# EAGLE design untitled (EAGLE 9.4.2)
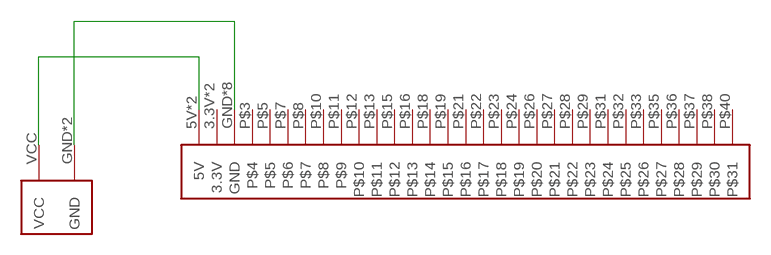
[diagram p0: schematic, sheet 1]

## Parts
U$1  DCジャック  [DCジャック]
U$2  PINHEADER_220  [PINHEADER_2*20]

## Nets
N$1: U$1.VCC U$2.5V U$2.5V_(5V)
N$2: U$1.GND U$1.GND2(GND) U$2.GND U$2.GND1(GND) U$2.GND2(GND) U$2.GND3(GND) U$2.GND4(GND) U$2.GND5(GND) U$2.GND6(GND) U$2.GND7(GND)
Unconnected: U$2.3.3V U$2.3.3V_(3.3V) U$2.P$3 U$2.P$5 U$2.P$7 U$2.P$8 U$2.P$10 U$2.P$11 U$2.P$12 U$2.P$13 U$2.P$15 U$2.P$16 U$2.P$18 U$2.P$19 U$2.P$21 U$2.P$22 U$2.P$23 U$2.P$24 U$2.P$26 U$2.P$27 U$2.P$28 U$2.P$29 U$2.P$31 U$2.P$32 U$2.P$33 U$2.P$35 U$2.P$36 U$2.P$37 U$2.P$38 U$2.P$40

## Library data of the parts
U$1 = dcジャック_mirror:DCジャック
U$2 = thinker_pinheader:PINHEADER_2*20

## Board
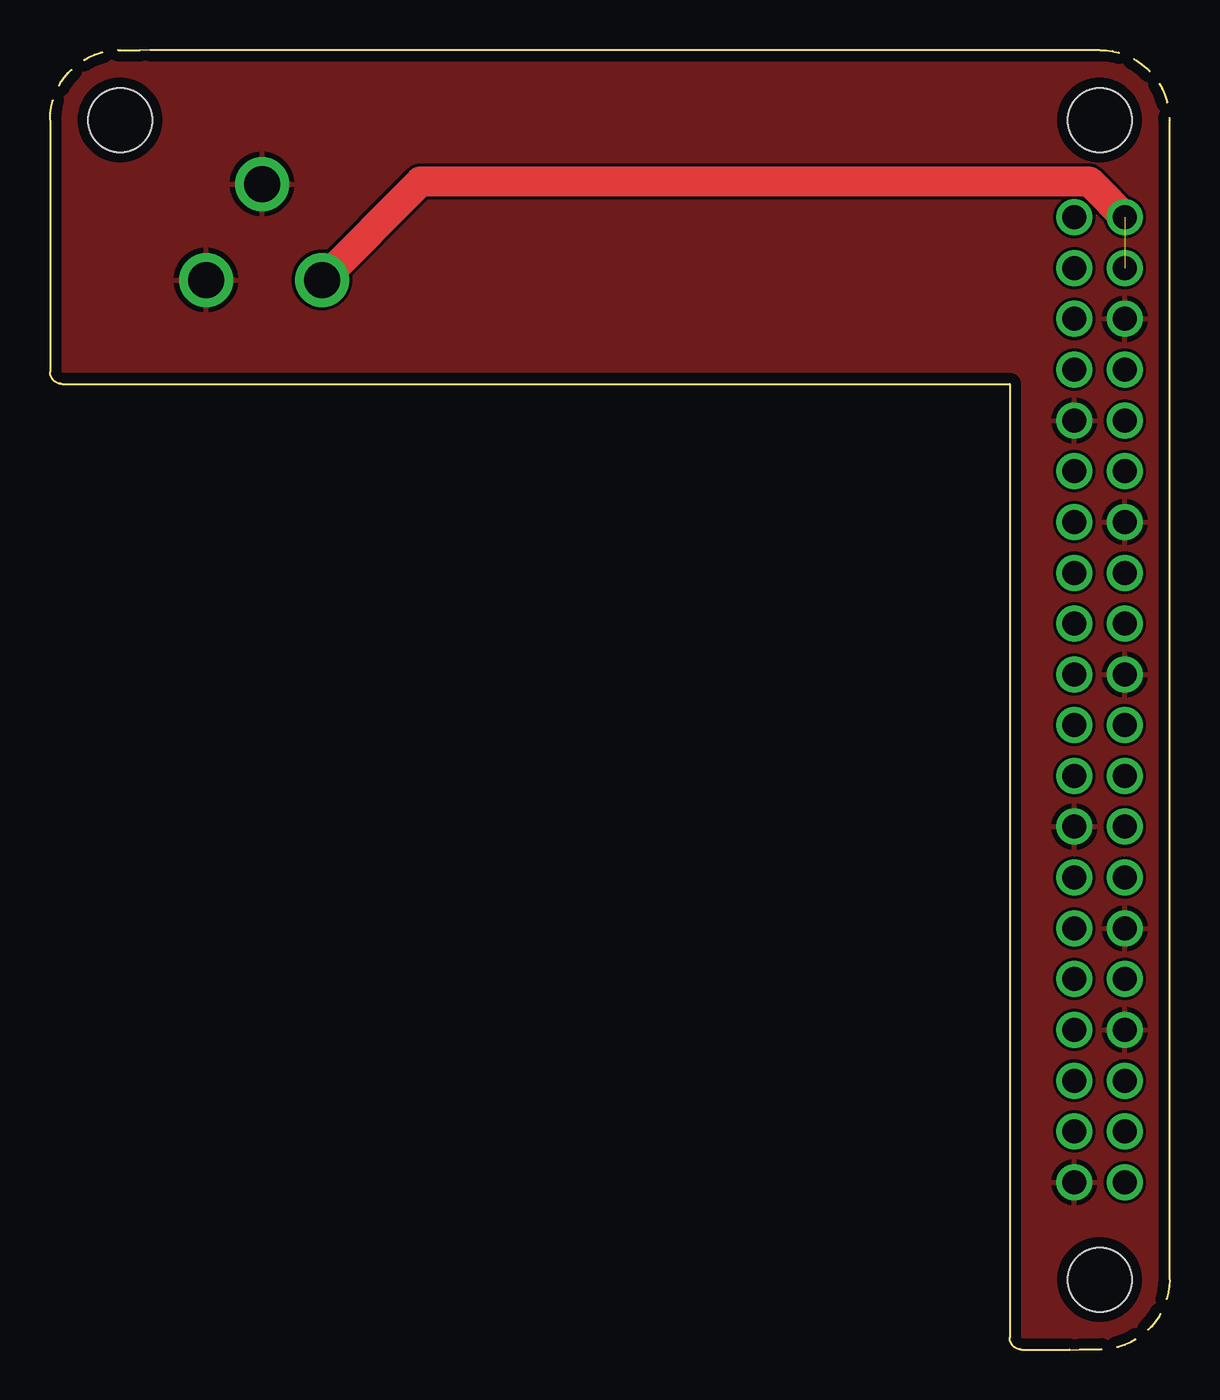
[diagram p1: board, top side]
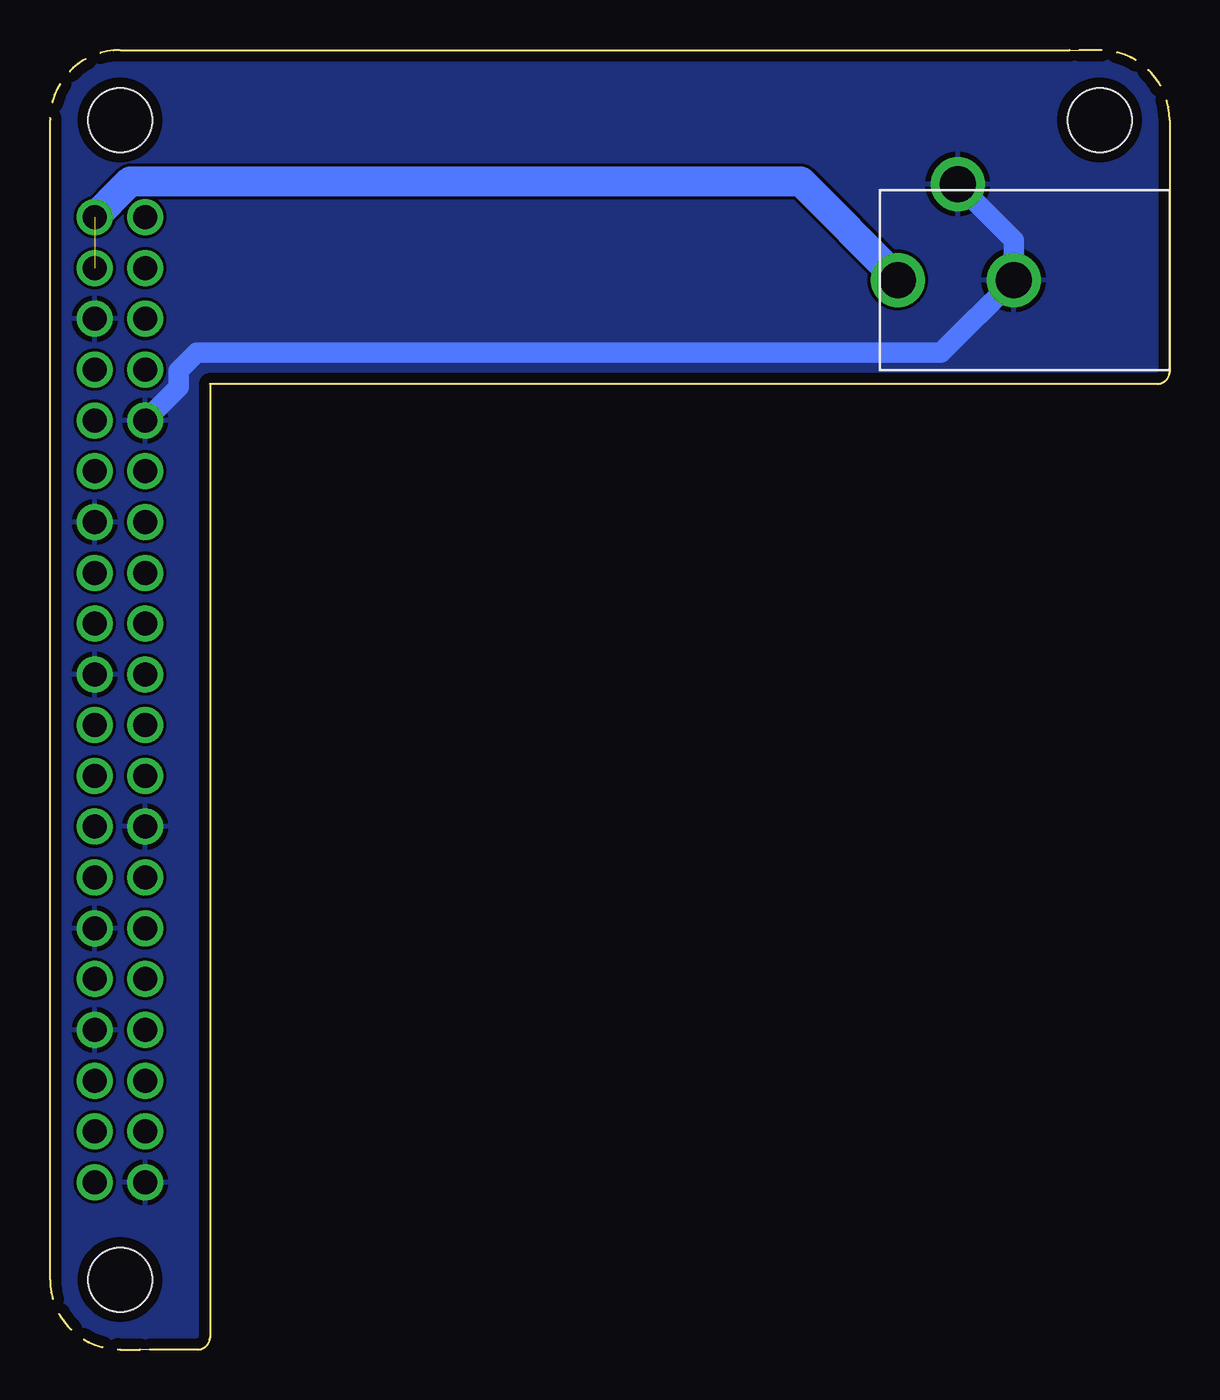
[diagram p2: board, bottom side, seen from below]

Size 56 x 65 mm. Coordinates in mm from the lower left corner, seen from the top.
Outline: 51,0 48.6,0 arc-90 48,0.6 48,48.3 0.6,48.3 arc-90 0,48.9 0,61.5 arc-90 3.5,65
Outline: 51,0 52.5,0
Outline: 5,65 52.5,65 arc-90 56,61.5 56,3.5 arc-90 52.5,0
Outline: 5,65 3.5,65
Outline: 3.5,65 5,65
Outline: 52.5,0 51,0
Copper layers (1*16): Top 0.035mm / dielectric 1.5mm / Bottom 0.035mm
Design rules "default *": minimum track width 6mil, minimum drill 0.35mm, track to track 6mil, track to pad 6mil, pad to pad 6mil, via to via 6mil, smd to smd 6mil, copper to edge 20mil, drill to drill 6mil, minimum pad ring 10mil, minimum via ring 8mil, stop-mask expansion 4mil, vias tented up to drill 0mil, thermal gap 10mil
Holes 3.2 mm at 3.5,61.5 52.5,61.5 52.5,3.5

### Footprints (pad centres in the part's own frame; a part is rotated, then mirrored left to right if it is on the bottom)
DCジャック = drill 1.8: GND 7.8,0; GND2 10.6,4.8; VCC 13.6,0
PINHEADER_2*20 = drill 1.2: 3.3V 0,0; 3.3V_ 0,-20.32; 5V 2.54,0; 5V_ 2.54,-2.54; GND 2.54,-5.08; GND1 0,-10.16; GND2 2.54,-15.24; GND3 2.54,-22.86; GND4 0,-30.48; GND5 2.54,-35.56; GND6 2.54,-40.64; GND7 0,-48.26; P$3 0,-2.54; P$5 0,-5.08; P$7 0,-7.62; P$8 2.54,-7.62; P$10 2.54,-10.16; P$11 0,-12.7; P$12 2.54,-12.7; P$13 0,-15.24; P$15 0,-17.78; P$16 2.54,-17.78; P$18 2.54,-20.32; P$19 0,-22.86; P$21 0,-25.4; P$22 2.54,-25.4; P$23 0,-27.94; P$24 2.54,-27.94; P$26 2.54,-30.48; P$27 0,-33.02; P$28 2.54,-33.02; P$29 0,-35.56; P$31 0,-38.1; P$32 2.54,-38.1; P$33 0,-40.64; P$35 0,-43.18; P$36 2.54,-43.18; P$37 0,-45.72; P$38 2.54,-45.72; P$40 2.54,-48.26

### Placement (x,y rotation side)
U$1  0,53.5 0 top
U$2  51.23,56.63 0 top

### Tracks (layer width: path | path; a pad name or v marks a point on that pad's centre or on a via)
N$1  (1 unrouted)
  Top 1.5: U$2.5V 53.03,57.37 53.03,57.38 51.98,58.43 18.53,58.43 U$1.VCC
  Bottom 1.5: 13.57,53.57 13.58,53.57 18.44,58.43 51.98,58.43 53.03,57.38 53.03,57.37 U$2.5V
N$2
  Bottom 1.016: U$1.GND2 7.8,55.5 U$1.GND 11.43,49.88 48.65,49.88 49.58,48.95 49.58,48.12 U$2.GND1
  pour Top: -2,66 57,66 57,-1 -2,-1
  pour Bottom: -2,66 57,66 57,-1 -2,-1